# EAGLE design Arduino_Mega14x (EAGLE 9.5.2)
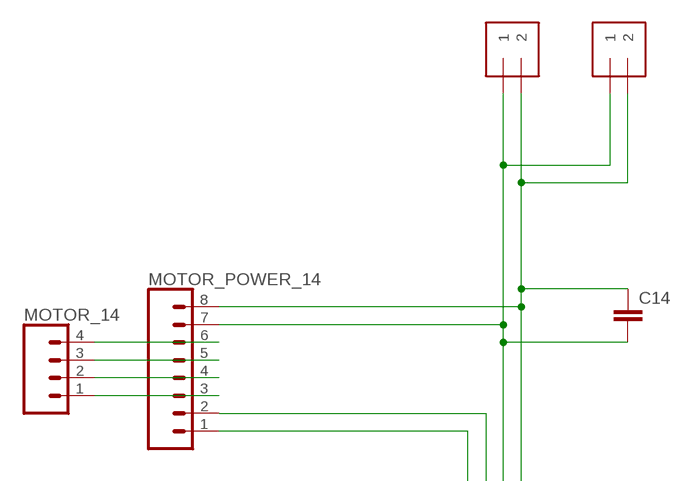
[diagram p0: schematic, sheet 1, part 1 of 3]
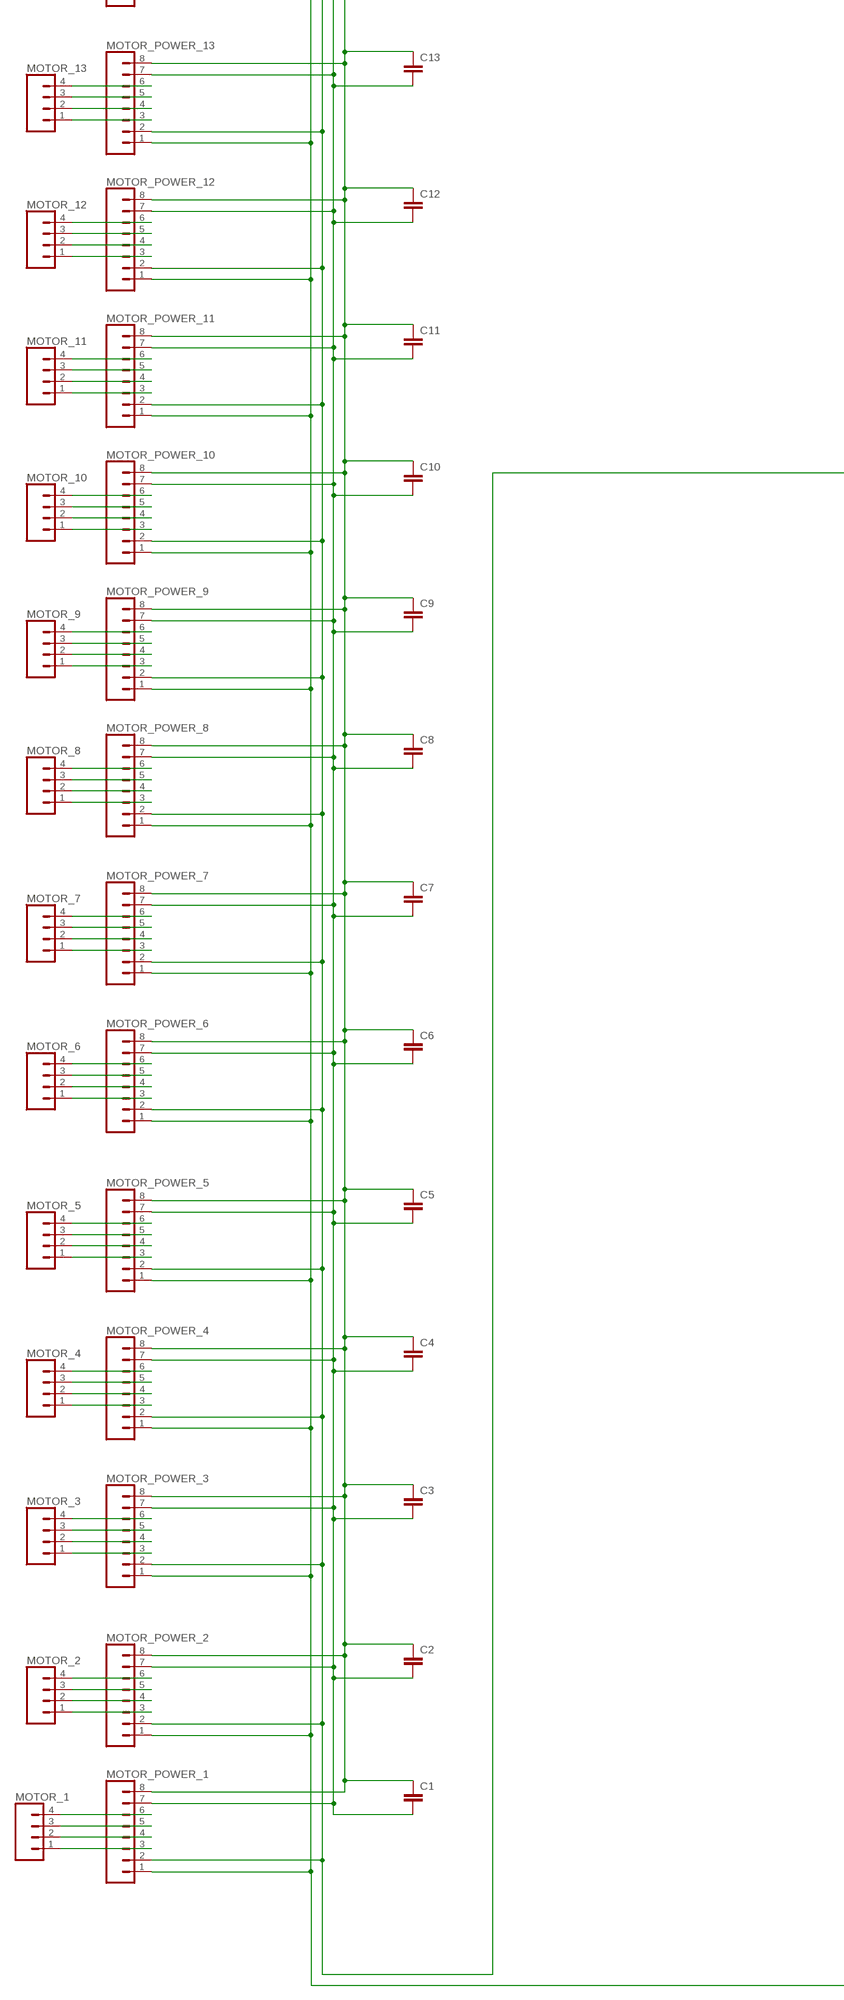
[diagram p1: schematic, sheet 1, part 2 of 3]
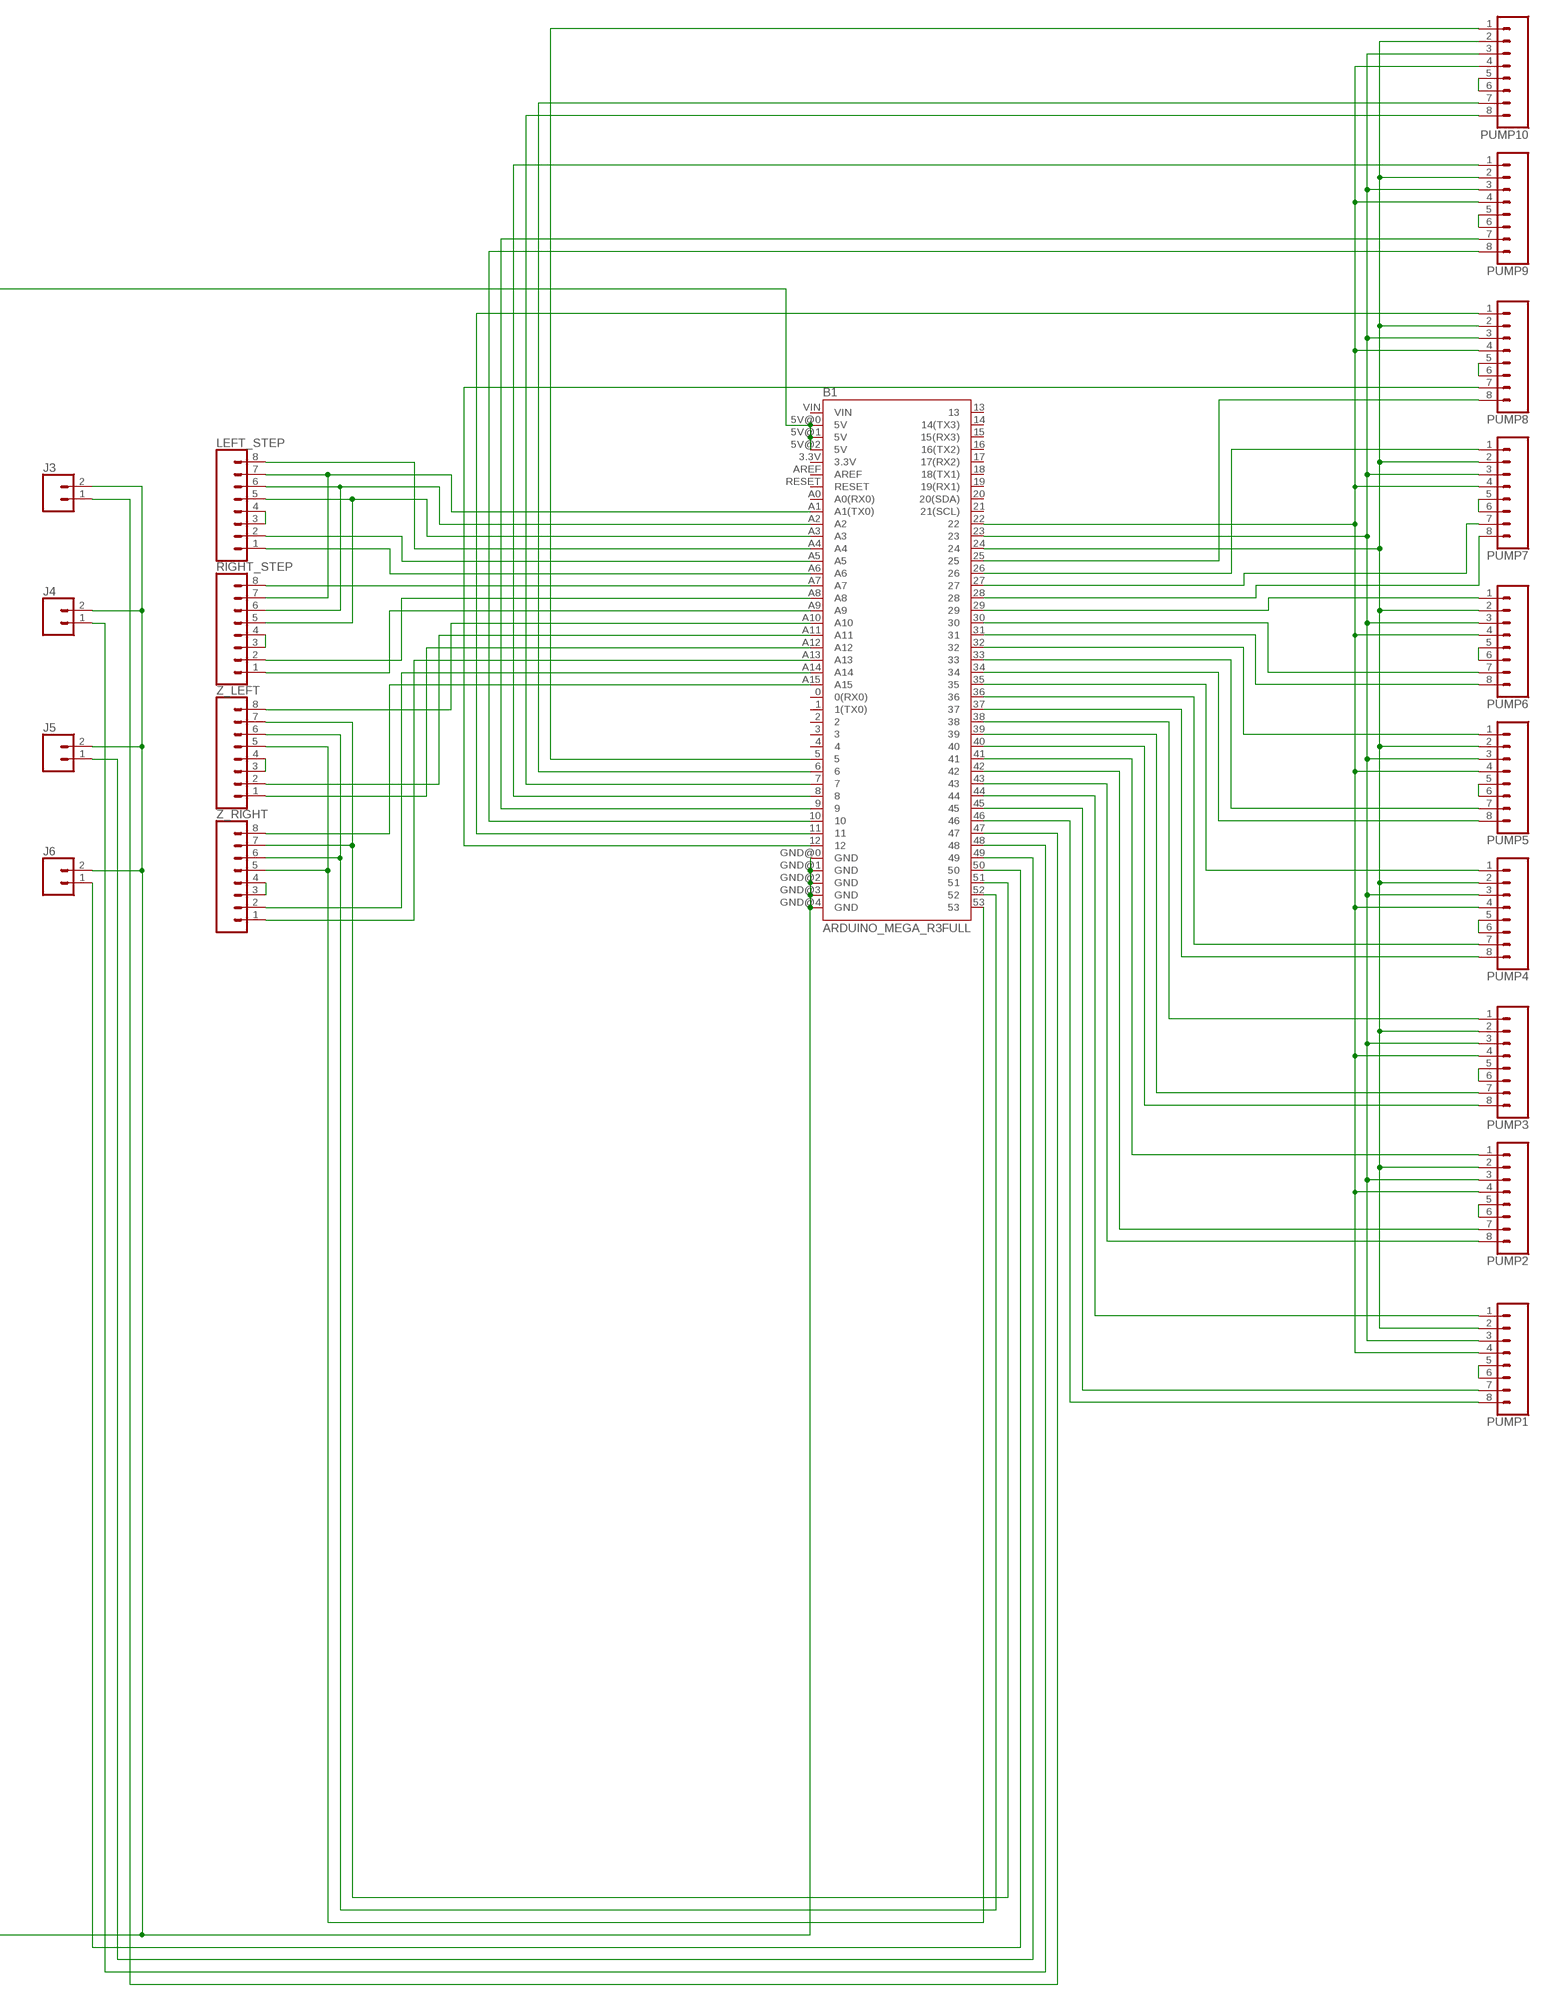
[diagram p2: schematic, sheet 1, part 3 of 3]

## Parts
B1  ARDUINO_MEGA_R3FULL  [ARDUINO_MEGA]
C1  C5/2.5  [C5B2.5]
C2  C5/2.5  [C5B2.5]
C3  C5/2.5  [C5B2.5]
C4  C5/2.5  [C5B2.5]
C5  C5/2.5  [C5B2.5]
C6  C5/2.5  [C5B2.5]
C7  C5/2.5  [C5B2.5]
C8  C5/2.5  [C5B2.5]
C9  C5/2.5  [C5B2.5]
C10  C5/2.5  [C5B2.5]
C11  C5/2.5  [C5B2.5]
C12  C5/2.5  [C5B2.5]
C13  C5/2.5  [C5B2.5]
C14  C5/2.5  [C5B2.5]
J1  1X2-3.5MM  [1X2-3.5MM]
J2  1X2-3.5MM  [1X2-3.5MM]
J3  CONN_02  [1X02]
J4  CONN_02  [1X02]
J5  CONN_02  [1X02]
J6  CONN_02  [1X02]
LEFT_STEP  CONN_08"  [1X08]
MOTOR_1  CONN_04  [1X04]
MOTOR_2  CONN_04  [1X04]
MOTOR_3  CONN_04  [1X04]
MOTOR_4  CONN_04  [1X04]
MOTOR_5  CONN_04  [1X04]
MOTOR_6  CONN_04  [1X04]
MOTOR_7  CONN_04  [1X04]
MOTOR_8  CONN_04  [1X04]
MOTOR_9  CONN_04  [1X04]
MOTOR_10  CONN_04  [1X04]
MOTOR_11  CONN_04  [1X04]
MOTOR_12  CONN_04  [1X04]
MOTOR_13  CONN_04  [1X04]
MOTOR_14  CONN_04  [1X04]
MOTOR_POWER_1  CONN_08"  [1X08]
MOTOR_POWER_2  CONN_08"  [1X08]
MOTOR_POWER_3  CONN_08"  [1X08]
MOTOR_POWER_4  CONN_08"  [1X08]
MOTOR_POWER_5  CONN_08"  [1X08]
MOTOR_POWER_6  CONN_08"  [1X08]
MOTOR_POWER_7  CONN_08"  [1X08]
MOTOR_POWER_8  CONN_08"  [1X08]
MOTOR_POWER_9  CONN_08"  [1X08]
MOTOR_POWER_10  CONN_08"  [1X08]
MOTOR_POWER_11  CONN_08"  [1X08]
MOTOR_POWER_12  CONN_08"  [1X08]
MOTOR_POWER_13  CONN_08"  [1X08]
MOTOR_POWER_14  CONN_08"  [1X08]
PUMP1  CONN_08"  [1X08]
PUMP2  CONN_08"  [1X08]
PUMP3  CONN_08"  [1X08]
PUMP4  CONN_08"  [1X08]
PUMP5  CONN_08"  [1X08]
PUMP6  CONN_08"  [1X08]
PUMP7  CONN_08"  [1X08]
PUMP8  CONN_08"  [1X08]
PUMP9  CONN_08"  [1X08]
PUMP10  CONN_08"  [1X08]
RIGHT_STEP  CONN_08"  [1X08]
Z_LEFT  CONN_08"  [1X08]
Z_RIGHT  CONN_08"  [1X08]

## Nets
N$1: MOTOR_1.1 MOTOR_POWER_1.3
N$2: MOTOR_1.2 MOTOR_POWER_1.4
N$3: MOTOR_1.3 MOTOR_POWER_1.5
N$4: LEFT_STEP.3 LEFT_STEP.4
N$5: MOTOR_1.4 MOTOR_POWER_1.6
N$6: MOTOR_2.1 MOTOR_POWER_2.3
N$7: MOTOR_2.2 MOTOR_POWER_2.4
N$8: RIGHT_STEP.3 RIGHT_STEP.4
N$9: MOTOR_2.3 MOTOR_POWER_2.5
N$10: MOTOR_2.4 MOTOR_POWER_2.6
N$11: MOTOR_3.1 MOTOR_POWER_3.3
N$12: MOTOR_3.2 MOTOR_POWER_3.4
N$13: MOTOR_3.3 MOTOR_POWER_3.5
N$14: MOTOR_3.4 MOTOR_POWER_3.6
N$15: MOTOR_4.1 MOTOR_POWER_4.3
N$16: MOTOR_4.2 MOTOR_POWER_4.4
N$17: MOTOR_4.3 MOTOR_POWER_4.5
N$18: Z_LEFT.3 Z_LEFT.4
N$19: MOTOR_4.4 MOTOR_POWER_4.6
N$20: MOTOR_5.1 MOTOR_POWER_5.3
N$21: MOTOR_5.2 MOTOR_POWER_5.4
N$22: MOTOR_5.3 MOTOR_POWER_5.5
N$23: MOTOR_5.4 MOTOR_POWER_5.6
N$24: MOTOR_6.1 MOTOR_POWER_6.3
N$25: Z_RIGHT.3 Z_RIGHT.4
N$26: MOTOR_6.2 MOTOR_POWER_6.4
N$27: PUMP1.5 PUMP1.6
N$28: MOTOR_6.3 MOTOR_POWER_6.5
N$29: MOTOR_6.4 MOTOR_POWER_6.6
N$30: MOTOR_7.1 MOTOR_POWER_7.3
N$31: MOTOR_7.2 MOTOR_POWER_7.4
N$32: PUMP2.5 PUMP2.6
N$33: MOTOR_7.3 MOTOR_POWER_7.5
N$34: MOTOR_7.4 MOTOR_POWER_7.6
N$35: PUMP3.5 PUMP3.6
N$36: MOTOR_8.1 MOTOR_POWER_8.3
N$37: MOTOR_8.2 MOTOR_POWER_8.4
N$38: MOTOR_8.3 MOTOR_POWER_8.5
N$39: MOTOR_8.4 MOTOR_POWER_8.6
N$40: PUMP4.5 PUMP4.6
N$41: MOTOR_9.1 MOTOR_POWER_9.3
N$42: MOTOR_9.2 MOTOR_POWER_9.4
N$43: MOTOR_9.3 MOTOR_POWER_9.5
N$44: PUMP5.5 PUMP5.6
N$45: MOTOR_9.4 MOTOR_POWER_9.6
N$46: MOTOR_10.1 MOTOR_POWER_10.3
N$47: MOTOR_10.2 MOTOR_POWER_10.4
N$48: PUMP6.5 PUMP6.6
N$49: MOTOR_10.3 MOTOR_POWER_10.5
N$50: MOTOR_10.4 MOTOR_POWER_10.6
N$51: MOTOR_11.1 MOTOR_POWER_11.3
N$52: PUMP7.5 PUMP7.6
N$53: MOTOR_11.2 MOTOR_POWER_11.4
N$54: MOTOR_11.3 MOTOR_POWER_11.5
N$55: MOTOR_11.4 MOTOR_POWER_11.6
N$56: PUMP8.5 PUMP8.6
N$57: MOTOR_12.1 MOTOR_POWER_12.3
N$58: MOTOR_12.2 MOTOR_POWER_12.4
N$59: MOTOR_12.3 MOTOR_POWER_12.5
N$60: PUMP9.5 PUMP9.6
N$61: MOTOR_12.4 MOTOR_POWER_12.6
N$62: MOTOR_13.1 MOTOR_POWER_13.3
N$63: MOTOR_13.2 MOTOR_POWER_13.4
N$64: PUMP10.5 PUMP10.6
N$65: MOTOR_13.3 MOTOR_POWER_13.5
N$66: MOTOR_13.4 MOTOR_POWER_13.6
N$67: MOTOR_14.1 MOTOR_POWER_14.3
N$68: MOTOR_14.2 MOTOR_POWER_14.4
N$69: MOTOR_14.3 MOTOR_POWER_14.5
N$70: MOTOR_14.4 MOTOR_POWER_14.6
N$71: B1.GND@0(GND) B1.GND@1(GND) B1.GND@2(GND) B1.GND@3(GND) B1.GND@4(GND) J3.2 J4.2 J5.2 J6.2 MOTOR_POWER_1.1 MOTOR_POWER_2.1 MOTOR_POWER_3.1 MOTOR_POWER_4.1 MOTOR_POWER_5.1 MOTOR_POWER_6.1 MOTOR_POWER_7.1 MOTOR_POWER_8.1 MOTOR_POWER_9.1 MOTOR_POWER_10.1 MOTOR_POWER_11.1 MOTOR_POWER_12.1 MOTOR_POWER_13.1 MOTOR_POWER_14.1
N$72: B1.A1(A1(TX0)) LEFT_STEP.7 RIGHT_STEP.7
N$73: B1.A2 LEFT_STEP.6 RIGHT_STEP.6
N$74: B1.A3 LEFT_STEP.5 RIGHT_STEP.5
N$75: B1.51 Z_LEFT.7 Z_RIGHT.7
N$76: B1.52 Z_LEFT.6 Z_RIGHT.6
N$77: B1.53 Z_LEFT.5 Z_RIGHT.5
N$78: B1.22 PUMP1.4 PUMP2.4 PUMP3.4 PUMP4.4 PUMP5.4 PUMP6.4 PUMP7.4 PUMP8.4 PUMP9.4 PUMP10.4
N$79: B1.23 PUMP1.3 PUMP2.3 PUMP3.3 PUMP4.3 PUMP5.3 PUMP6.3 PUMP7.3 PUMP8.3 PUMP9.3 PUMP10.3
N$80: B1.24 PUMP1.2 PUMP2.2 PUMP3.2 PUMP4.2 PUMP5.2 PUMP6.2 PUMP7.2 PUMP8.2 PUMP9.2 PUMP10.2
N$81: B1.A15 Z_RIGHT.8
N$82: B1.5V@0(5V) B1.5V@1(5V) B1.5V@2(5V) MOTOR_POWER_1.2 MOTOR_POWER_2.2 MOTOR_POWER_3.2 MOTOR_POWER_4.2 MOTOR_POWER_5.2 MOTOR_POWER_6.2 MOTOR_POWER_7.2 MOTOR_POWER_8.2 MOTOR_POWER_9.2 MOTOR_POWER_10.2 MOTOR_POWER_11.2 MOTOR_POWER_12.2 MOTOR_POWER_13.2 MOTOR_POWER_14.2
N$83: C1.2 C2.2 C3.2 C4.2 C5.2 C6.2 C7.2 C8.2 C9.2 C10.2 C11.2 C12.2 C13.2 C14.2 J1.1 J2.1 MOTOR_POWER_1.7 MOTOR_POWER_2.7 MOTOR_POWER_3.7 MOTOR_POWER_4.7 MOTOR_POWER_5.7 MOTOR_POWER_6.7 MOTOR_POWER_7.7 MOTOR_POWER_8.7 MOTOR_POWER_9.7 MOTOR_POWER_10.7 MOTOR_POWER_11.7 MOTOR_POWER_12.7 MOTOR_POWER_13.7 MOTOR_POWER_14.7
N$84: C1.1 C2.1 C3.1 C4.1 C5.1 C6.1 C7.1 C8.1 C9.1 C10.1 C11.1 C12.1 C13.1 C14.1 J1.2 J2.2 MOTOR_POWER_1.8 MOTOR_POWER_2.8 MOTOR_POWER_3.8 MOTOR_POWER_4.8 MOTOR_POWER_5.8 MOTOR_POWER_6.8 MOTOR_POWER_7.8 MOTOR_POWER_8.8 MOTOR_POWER_9.8 MOTOR_POWER_10.8 MOTOR_POWER_11.8 MOTOR_POWER_12.8 MOTOR_POWER_13.8 MOTOR_POWER_14.8
N$85: B1.A14 Z_RIGHT.2
N$86: B1.A13 Z_RIGHT.1
N$87: B1.A12 Z_LEFT.1
N$88: B1.A11 Z_LEFT.2
N$89: B1.A10 Z_LEFT.8
N$90: B1.A9 RIGHT_STEP.1
N$91: B1.A8 RIGHT_STEP.2
N$92: B1.A7 RIGHT_STEP.8
N$93: B1.A6 LEFT_STEP.1
N$94: B1.A5 LEFT_STEP.2
N$95: B1.A4 LEFT_STEP.8
N$96: B1.50 J6.1
N$97: B1.49 J5.1
N$98: B1.48 J4.1
N$99: B1.47 J3.1
N$100: B1.46 PUMP1.8
N$101: B1.45 PUMP1.7
N$102: B1.44 PUMP1.1
N$103: B1.43 PUMP2.8
N$104: B1.42 PUMP2.7
N$105: B1.41 PUMP2.1
N$106: B1.40 PUMP3.8
N$107: B1.39 PUMP3.7
N$108: B1.38 PUMP3.1
N$109: B1.37 PUMP4.8
N$110: B1.36 PUMP4.7
N$111: B1.35 PUMP4.1
N$112: B1.34 PUMP5.8
N$113: B1.33 PUMP5.7
N$114: B1.32 PUMP5.1
N$115: B1.31 PUMP6.8
N$116: B1.30 PUMP6.7
N$117: B1.29 PUMP6.1
N$118: B1.28 PUMP7.8
N$119: B1.27 PUMP7.7
N$120: B1.26 PUMP7.1
N$121: B1.25 PUMP8.8
N$122: B1.12 PUMP8.7
N$123: B1.11 PUMP8.1
N$124: B1.10 PUMP9.8
N$125: B1.9 PUMP9.7
N$126: B1.8 PUMP9.1
N$127: B1.7 PUMP10.8
N$128: B1.6 PUMP10.7
N$129: B1.5 PUMP10.1
Unconnected: B1.0(0(RX0)) B1.1(1(TX0)) B1.2 B1.3 B1.3.3V B1.4 B1.13 B1.14(14(TX3)) B1.15(15(RX3)) B1.16(16(TX2)) B1.17(17(RX2)) B1.18(18(TX1)) B1.19(19(RX1)) B1.20(20(SDA)) B1.21(21(SCL)) B1.A0(A0(RX0)) B1.AREF B1.RESET B1.VIN

## Library data of the parts
B1 = SparkFun-Mega_Shield:ARDUINO_MEGA_R3: Arduino Mega R3 ATmega2560 R3 compatible footprint. SparkFun Products: Arduino Mega 2560 R3 <https://www.sparkfun.com/products/11061>
C1-C14 = capacitor-wima:C: CAPACITOR naming: grid - package width
J1 J2 = adafruit:1X2: 3.5mm Terminal block http://www.ladyada.net/library/pcb/eaglelibrary.html
J3-J6 = SparkFun-Connectors:CONN_02: Multi connection point. Often used as Generic Header-pin footprint for 0.1 inch spaced/style header connections On any of the 0.1 inch spaced packages, you can populate with these: Break Away Headers - Straight <https://www.sparkfun.com/products/116> (PRT-00116) Break Away Male Headers - Right Angle <https://www.sparkfun.com/products/553> (PRT-00553) Female Headers <https://www.sparkfun.com/products/115> (PRT-00115) Break Away Headers - Machine Pin <https://www.sparkfun.com/products/117> (PRT-00117) Break Away Female Headers - Swiss Machine Pin <https://www.sparkfun.com/products/743> (PRT-00743) For SCREWTERMINALS and SPRING TERMINALS visit here: Screw Terimnals on SparkFun.com <https://www.sparkfun.com/search/results?term=Screw+Terminals> (5mm/3.5mm/2.54mm spacing) This device is also useful as a general connection point to wire up your design to another part of your project. Our various solder wires solder well into these plated through hole pads. Hook-Up Wire - Assortment (Stranded, 22 AWG) <https://www.sparkfun.com/products/11375> (PRT-11375) Hook-Up Wire - Assortment (Solid Core, 22 AWG) <https://www.sparkfun.com/products/11367> (PRT-11367) View the entire wire category on our website here <https://www.sparkfun.com/categories/141> Special notes: Molex polarized connector foot print use with: PRT-08233 with associated crimp pins and housings. 2.54_SCREWTERM for use with PRT-10571. 3.5mm Screw Terminal footprints for PRT-08084 5mm Screw Terminal footprints for use with PRT-08432
LEFT_STEP MOTOR_POWER_1-MOTOR_POWER_14 PUMP1-PUMP10 RIGHT_STEP Z_LEFT Z_RIGHT = SparkFun-Connectors:CONN_08: Multi connection point. Often used as Generic Header-pin footprint for 0.1 inch spaced/style header connections On any of the 0.1 inch spaced packages, you can populate with these: Break Away Headers - Straight <https://www.sparkfun.com/products/116> (PRT-00116) Break Away Male Headers - Right Angle <https://www.sparkfun.com/products/553> (PRT-00553) Female Headers <https://www.sparkfun.com/products/115> (PRT-00115) Break Away Headers - Machine Pin <https://www.sparkfun.com/products/117> (PRT-00117) Break Away Female Headers - Swiss Machine Pin <https://www.sparkfun.com/products/743> (PRT-00743) Arduino Stackable Header - 8 Pin <https://www.sparkfun.com/products/9279> (PRT-09279) For SCREWTERMINALS and SPRING TERMINALS visit here: Screw Terimnals on SparkFun.com <https://www.sparkfun.com/search/results?term=Screw+Terminals> (5mm/3.5mm/2.54mm spacing) This device is also useful as a general connection point to wire up your design to another part of your project. Our various solder wires solder well into these plated through hole pads. Hook-Up Wire - Assortment (Stranded, 22 AWG) <https://www.sparkfun.com/products/11375> (PRT-11375) Hook-Up Wire - Assortment (Solid Core, 22 AWG) <https://www.sparkfun.com/products/11367> (PRT-11367) View the entire wire category on our website here <https://www.sparkfun.com/categories/141> Special notes: Molex polarized connector foot print use with SKU : PRT-08231 with associated crimp pins and housings. 1MM SMD Version SKU: PRT-10208 NOTES ON THE VARIANTS LOCK and LOCK_LONGPADS... This footprint was designed to help hold the alignment of a through-hole component (i.e. 6-pin header) while soldering it into place. You may notice that each hole has been shifted either up or down by 0.005 of an inch from it's more standard position (which is a perfectly straight line). This slight alteration caused the pins (the squares in the middle) to touch the edges of the holes. Because they are alternating, it causes a "brace" to hold the component in place. 0.005 has proven to be the perfect amount of "off-center" position when using our standard breakaway headers. Although looks a little odd when you look at the bare footprint, once you have a header in there, the alteration is very hard to notice. Also,if you push a header all the way into place, it is covered up entirely on the bottom side.; PROD_ID: CONN-08438
MOTOR_1-MOTOR_14 = SparkFun-Connectors:CONN_04: Multi connection point. Often used as Generic Header-pin footprint for 0.1 inch spaced/style header connections On any of the 0.1 inch spaced packages, you can populate with these: Break Away Headers - Straight <https://www.sparkfun.com/products/116> (PRT-00116) Break Away Male Headers - Right Angle <https://www.sparkfun.com/products/553> (PRT-00553) Female Headers <https://www.sparkfun.com/products/115> (PRT-00115) Break Away Headers - Machine Pin <https://www.sparkfun.com/products/117> (PRT-00117) Break Away Female Headers - Swiss Machine Pin <https://www.sparkfun.com/products/743> (PRT-00743) For SCREWTERMINALS and SPRING TERMINALS visit here: Screw Terimnals on SparkFun.com <https://www.sparkfun.com/search/results?term=Screw+Terminals> (5mm/3.5mm/2.54mm spacing) This device is also useful as a general connection point to wire up your design to another part of your project. Our various solder wires solder well into these plated through hole pads. Hook-Up Wire - Assortment (Stranded, 22 AWG) <https://www.sparkfun.com/products/11375> (PRT-11375) Hook-Up Wire - Assortment (Solid Core, 22 AWG) <https://www.sparkfun.com/products/11367> (PRT-11367) View the entire wire category on our website here <https://www.sparkfun.com/categories/141> Special notes: Molex polarized connector foot print use with SKU : PRT-08231 with associated crimp pins and housings. 1MM SMD Version SKU: PRT-10208; PROD_ID: CONN-09696

## Board
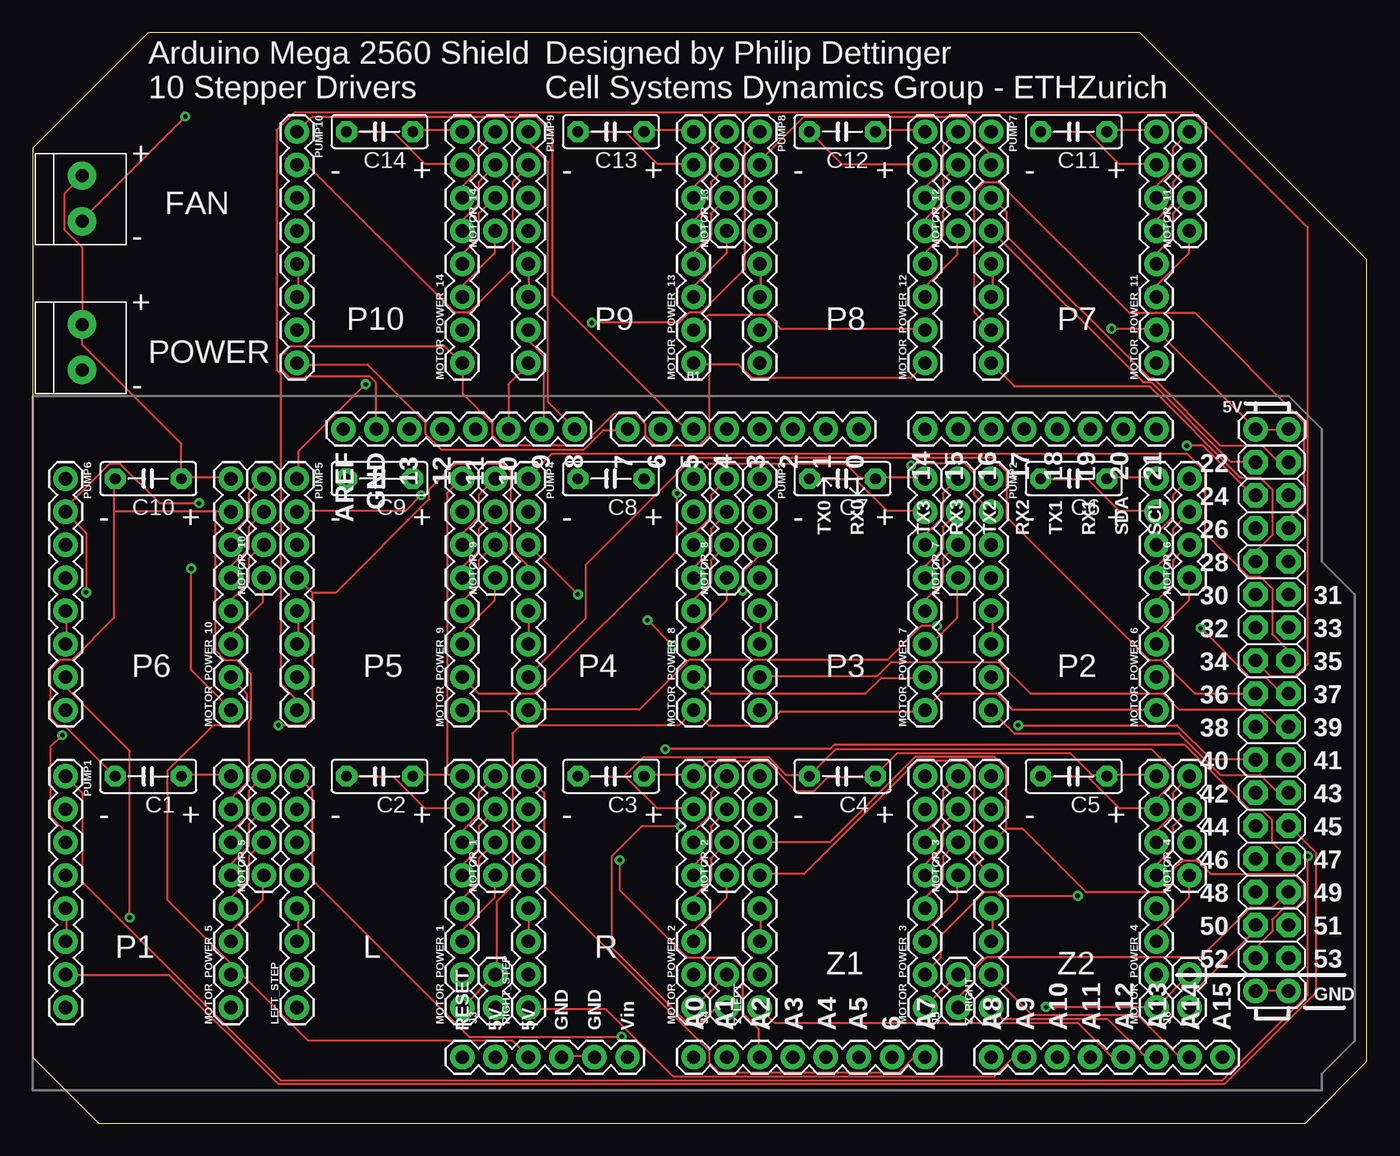
[diagram p3: board, top side]
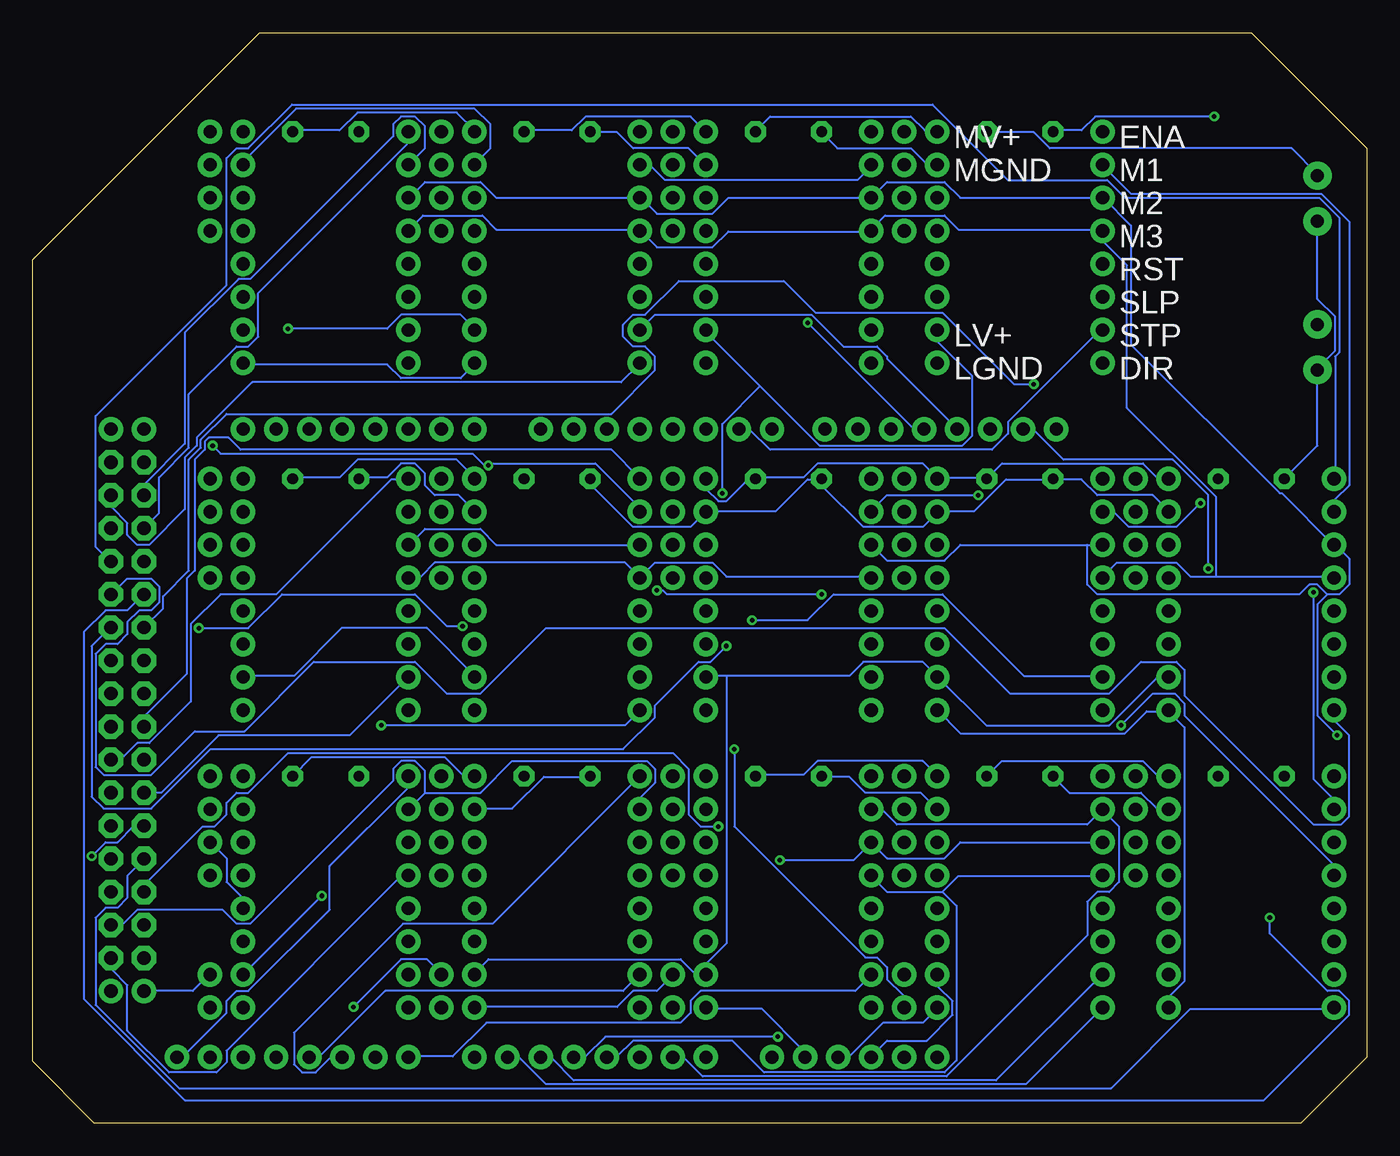
[diagram p4: board, bottom side, seen from below]

Size 102.54 x 83.82 mm. Coordinates in mm from the lower left corner, seen from the top.
Outline: 0,74.93 0,5.08 5.08,0 97.79,0 102.54,4.75 102.54,66.37 85.09,83.82 8.89,83.82 0,74.93
Copper layers (1*16): Top 0.035mm / dielectric 1.5mm / Bottom 0.035mm
Design rules "default": minimum track width 6mil, minimum drill 0.35mm, track to track 6mil, track to pad 6mil, pad to pad 6mil, via to via 6mil, smd to smd 6mil, copper to edge 40mil, drill to drill 6mil, minimum pad ring 10mil, minimum via ring 8mil, stop-mask expansion 4mil, vias tented up to drill 0mil, thermal gap 10mil

### Footprints (pad centres in the part's own frame; a part is rotated, then mirrored left to right if it is on the bottom)
ARDUINO_MEGA = drill 1.016 pad 1.88: 0 13.97,24.13; 1 11.43,24.13; 2 8.89,24.13; 3 6.35,24.13; 3.3V -13.97,-24.13; 4 3.81,24.13; 5 1.27,24.13; 5V@0 -11.43,-24.13; 5V@1 44.45,24.13; 5V@2 46.99,24.13; 6 -1.27,24.13; 7 -3.81,24.13; 8 -7.874,24.13; 9 -10.414,24.13; 10 -12.954,24.13; 11 -15.494,24.13; 12 -18.034,24.13; 13 -20.574,24.13; 14 19.05,24.13; 15 21.59,24.13; 16 24.13,24.13; 17 26.67,24.13; 18 29.21,24.13; 19 31.75,24.13; 20 34.29,24.13; 21 36.83,24.13; A0 1.27,-24.13; A1 3.81,-24.13; A2 6.35,-24.13; A3 8.89,-24.13; A4 11.43,-24.13; A5 13.97,-24.13; A6 16.51,-24.13; A7 19.05,-24.13; A8 24.13,-24.13; A9 26.67,-24.13; A10 29.21,-24.13; A11 31.75,-24.13; A12 34.29,-24.13; A13 36.83,-24.13; A14 39.37,-24.13; A15 41.91,-24.13; AREF -25.654,24.13; GND@0 -8.89,-24.13; GND@1 -6.35,-24.13; GND@2 44.45,-19.05; GND@3 46.99,-19.05; GND@4 -23.114,24.13; RESET -16.51,-24.13; VIN -3.81,-24.13 | drill 1.016 pad 1.88 octagon: 22 44.45,21.59; 23 46.99,21.59; 24 44.45,19.05; 25 46.99,19.05; 26 44.45,16.51; 27 46.99,16.51; 28 44.45,13.97; 29 46.99,13.97; 30 44.45,11.43; 31 46.99,11.43; 32 44.45,8.89; 33 46.99,8.89; 34 44.45,6.35; 35 46.99,6.35; 36 44.45,3.81; 37 46.99,3.81; 38 44.45,1.27; 39 46.99,1.27; 40 44.45,-1.27; 41 46.99,-1.27; 42 44.45,-3.81; 43 46.99,-3.81; 44 44.45,-6.35; 45 46.99,-6.35; 46 44.45,-8.89; 47 46.99,-8.89; 48 44.45,-11.43; 49 46.99,-11.43; 50 44.45,-13.97; 51 46.99,-13.97; 52 44.45,-16.51; 53 46.99,-16.51
C5B2.5 = drill 0.813 pad 1.6 octagon: 1 -2.54,0; 2 2.54,0
1X2-3.5MM = drill 1 pad 2.184: 1 1.8,0; 2 -1.7,0
1X02 = drill 1.016 pad 1.88: 1 0,0; 2 2.54,0
1X08 = drill 1.016 pad 1.88: 1 0,0; 2 2.54,0; 3 5.08,0; 4 7.62,0; 5 10.16,0; 6 12.7,0; 7 15.24,0; 8 17.78,0
1X04 = drill 1.016 pad 1.88: 1 0,0; 2 2.54,0; 3 5.08,0; 4 7.62,0

### Placement (x,y rotation side)
B1  49.53,29.21 0 top
C1  8.89,26.67 180 top
C2  26.67,26.67 180 top
C3  44.45,26.67 180 top
C4  62.23,26.67 180 top
C5  80.01,26.67 180 top
C6  80.01,49.53 180 top
C7  62.23,49.53 180 top
C8  44.45,49.53 180 top
C9  26.67,49.53 180 top
C10  8.89,49.53 180 top
C11  80.01,76.2 180 top
C12  62.23,76.2 180 top
C13  44.45,76.2 180 top
C14  26.67,76.2 180 top
J1  3.81,71.12 270 top
J2  3.81,59.69 270 top
J3  35.56,8.89 90 top
J4  53.34,8.89 90 top
J5  71.12,8.89 90 top
J6  88.9,8.89 90 top
LEFT_STEP  20.32,8.89 90 top
MOTOR_1  35.56,19.05 90 top
MOTOR_2  53.34,19.05 90 top
MOTOR_3  71.12,19.05 90 top
MOTOR_4  88.9,19.05 90 top
MOTOR_5  17.78,19.05 90 top
MOTOR_6  88.9,41.91 90 top
MOTOR_7  71.12,41.91 90 top
MOTOR_8  53.34,41.91 90 top
MOTOR_9  35.56,41.91 90 top
MOTOR_10  17.78,41.91 90 top
MOTOR_11  88.9,68.58 90 top
MOTOR_12  71.12,68.58 90 top
MOTOR_13  53.34,68.58 90 top
MOTOR_14  35.56,68.58 90 top
MOTOR_POWER_1  33.02,8.89 90 top
MOTOR_POWER_2  50.8,8.89 90 top
MOTOR_POWER_3  68.58,8.89 90 top
MOTOR_POWER_4  86.36,8.89 90 top
MOTOR_POWER_5  15.24,8.89 90 top
MOTOR_POWER_6  86.36,31.75 90 top
MOTOR_POWER_7  68.58,31.75 90 top
MOTOR_POWER_8  50.8,31.75 90 top
MOTOR_POWER_9  33.02,31.75 90 top
MOTOR_POWER_10  15.24,31.75 90 top
MOTOR_POWER_11  86.36,58.42 90 top
MOTOR_POWER_12  68.58,58.42 90 top
MOTOR_POWER_13  50.8,58.42 90 top
MOTOR_POWER_14  33.02,58.42 90 top
PUMP1  2.54,26.67 270 top
PUMP2  73.66,49.53 270 top
PUMP3  55.88,49.53 270 top
PUMP4  38.1,49.53 270 top
PUMP5  20.32,49.53 270 top
PUMP6  2.54,49.53 270 top
PUMP7  73.66,76.2 270 top
PUMP8  55.88,76.2 270 top
PUMP9  38.1,76.2 270 top
PUMP10  20.32,76.2 270 top
RIGHT_STEP  38.1,8.89 90 top
Z_LEFT  55.88,8.89 90 top
Z_RIGHT  73.66,8.89 90 top

### Tracks (layer width: path | path; a pad name or v marks a point on that pad's centre or on a via)
N$1
  Top 0.152: MOTOR_POWER_1.3 33.07,13.97 33.07,14.88 35.51,17.32 35.51,19 MOTOR_1.1
N$2
  Top 0.152: MOTOR_POWER_1.4 33.07,16.56 33.07,17.32 34.29,18.54 34.29,20.37 35.51,21.59 MOTOR_1.2
N$3
  Top 0.152: MOTOR_POWER_1.5 33.07,19.15 33.07,19.91 34.29,21.13 34.29,22.81 35.51,24.03 MOTOR_1.3
N$4
  Top 0.152: LEFT_STEP.3 20.42,13.97 20.42,16.41 LEFT_STEP.4
N$5
  Top 0.152: MOTOR_1.4 34.29,25.4 34.29,23.72 33.07,22.5 33.07,21.59 MOTOR_POWER_1.6
N$6
  Top 0.152: MOTOR_2.1 53.34,17.32 50.9,14.88 50.9,13.97 MOTOR_POWER_2.3
N$7
  Top 0.152: MOTOR_2.2 52.12,20.37 52.12,18.69 50.9,17.48 50.9,16.56 MOTOR_POWER_2.4
N$8
  Top 0.152: RIGHT_STEP.4 RIGHT_STEP.3
N$9
  Top 0.152: MOTOR_POWER_2.5 50.9,19.15 50.9,19.91 52.12,21.13 52.12,22.81 53.34,24.03 MOTOR_2.3
N$10
  Top 0.152: MOTOR_POWER_2.6 50.9,21.59 50.9,22.5 52.12,23.72 52.12,25.4 53.34,26.62 MOTOR_2.4
N$11
  Top 0.152: MOTOR_POWER_3.3 68.58,14.73 71.02,17.17 71.02,19 MOTOR_3.1
N$12
  Top 0.152: MOTOR_POWER_3.4 68.58,17.32 69.95,18.69 69.95,20.52 71.02,21.59 MOTOR_3.2
N$13
  Top 0.152: MOTOR_POWER_3.5 68.58,19.91 69.95,21.29 69.95,22.96 MOTOR_3.3
N$14
  Top 0.152: MOTOR_POWER_3.6 68.58,22.35 69.95,23.72 69.95,25.55 71.02,26.62 MOTOR_3.4
N$15
  Top 0.152: MOTOR_POWER_4.3 86.41,13.97 86.41,14.88 88.85,17.32 88.85,19 MOTOR_4.1
N$16
  Bottom 0.152: MOTOR_POWER_4.4 86.41,16.56 86.41,17.32 87.63,18.54 87.63,20.37 88.85,21.59 MOTOR_4.2
N$17
  Top 0.152: MOTOR_POWER_4.5 86.41,19.15 86.41,19.91 87.63,21.13 87.63,22.81 88.85,24.03 MOTOR_4.3
N$18
  Top 0.152: Z_LEFT.3 55.93,13.97 55.93,16.41 Z_LEFT.4
N$19
  Top 0.152: MOTOR_4.4 87.63,25.4 87.63,23.72 86.41,22.5 86.41,21.59 MOTOR_POWER_4.6
N$20
  Top 0.152: MOTOR_POWER_5.3 15.24,14.73 17.68,17.17 17.68,19 MOTOR_5.1
N$21
  Top 0.152: MOTOR_POWER_5.4 15.24,17.32 16.61,18.69 16.61,20.52 17.68,21.59 MOTOR_5.2
N$22
  Top 0.152: MOTOR_POWER_5.5 15.24,19.91 16.61,21.29 16.61,22.96 MOTOR_5.3
N$23
  Top 0.152: MOTOR_POWER_5.6 15.24,22.35 16.61,23.72 16.61,25.55 17.68,26.62 MOTOR_5.4
N$24
  Top 0.152: MOTOR_POWER_6.3 86.41,36.83 86.41,37.74 88.85,40.18 88.85,41.86 MOTOR_6.1
N$25
  Top 0.152: Z_RIGHT.3 73.76,13.97 73.76,16.41 Z_RIGHT.4
N$26
  Top 0.152: MOTOR_POWER_6.4 86.41,39.42 86.41,40.18 87.63,41.4 87.63,43.23 88.85,44.45 MOTOR_6.2
N$27
  Top 0.152: PUMP1.6 2.59,13.97 2.59,16.41 PUMP1.5
N$28
  Top 0.152: MOTOR_POWER_6.5 86.41,42.01 86.41,42.77 87.63,43.99 87.63,45.67 88.85,46.89 MOTOR_6.3
N$29
  Top 0.152: MOTOR_6.4 87.63,48.26 87.63,46.58 86.41,45.36 86.41,44.45 MOTOR_POWER_6.6
N$30
  Top 0.152: MOTOR_POWER_7.3 69.04,36.83 71.02,38.81 71.02,41.86 MOTOR_7.1
N$31
  Top 0.152: MOTOR_POWER_7.4 68.58,40.18 69.95,41.55 69.95,43.38 71.02,44.45 MOTOR_7.2
N$32
  Top 0.152: PUMP2.6 73.76,36.83 73.76,39.27 PUMP2.5
N$33
  Top 0.152: MOTOR_POWER_7.5 68.58,42.77 69.95,44.14 69.95,45.82 MOTOR_7.3
N$34
  Top 0.152: MOTOR_POWER_7.6 68.58,45.21 69.95,46.58 69.95,48.41 71.02,49.48 MOTOR_7.4
N$35
  Top 0.152: PUMP3.6 55.93,36.83 55.93,39.27 PUMP3.5
N$36
  Top 0.152: MOTOR_8.1 53.34,40.18 50.9,37.74 50.9,36.83 MOTOR_POWER_8.3
N$37
  Top 0.152: MOTOR_8.2 52.12,43.23 52.12,41.55 50.9,40.34 50.9,39.42 MOTOR_POWER_8.4
N$38
  Top 0.152: MOTOR_POWER_8.5 50.9,42.01 50.9,42.77 52.12,43.99 52.12,45.67 53.34,46.89 MOTOR_8.3
N$39
  Top 0.152: MOTOR_POWER_8.6 50.9,44.45 50.9,45.36 52.12,46.58 52.12,48.26 53.34,49.48 MOTOR_8.4
N$40
  Top 0.152: PUMP4.5 PUMP4.6
N$41
  Top 0.152: MOTOR_POWER_9.3 33.07,36.83 33.07,37.74 35.51,40.18 35.51,41.86 MOTOR_9.1
N$42
  Top 0.152: MOTOR_POWER_9.4 33.07,39.42 33.07,40.18 34.29,41.4 34.29,43.23 35.51,44.45 MOTOR_9.2
N$43
  Top 0.152: MOTOR_POWER_9.5 33.07,42.01 33.07,42.77 34.29,43.99 34.29,45.67 35.51,46.89 MOTOR_9.3
N$44
  Top 0.152: PUMP5.6 20.42,36.83 20.42,39.27 PUMP5.5
N$45
  Top 0.152: MOTOR_9.4 34.29,48.26 34.29,46.58 33.07,45.36 33.07,44.45 MOTOR_POWER_9.6
N$46
  Top 0.152: MOTOR_POWER_10.3 15.24,37.59 17.68,40.03 17.68,41.86 MOTOR_10.1
N$47
  Top 0.152: MOTOR_POWER_10.4 15.24,40.18 16.61,41.55 16.61,43.38 17.68,44.45 MOTOR_10.2
N$48
  Top 0.152: PUMP6.6 2.59,36.83 2.59,39.27 PUMP6.5
N$49
  Top 0.152: MOTOR_POWER_10.5 15.24,42.77 16.61,44.14 16.61,45.82 MOTOR_10.3
N$50
  Top 0.152: MOTOR_POWER_10.6 15.24,45.21 16.61,46.58 16.61,48.41 17.68,49.48 MOTOR_10.4
N$51
  Top 0.152: MOTOR_POWER_11.3 86.41,63.5 86.41,64.41 88.85,66.85 88.85,68.53 MOTOR_11.1
N$52
  Top 0.152: PUMP7.6 73.76,63.5 73.76,65.94 PUMP7.5
N$53
  Top 0.152: MOTOR_POWER_11.4 86.41,66.09 86.41,66.85 87.63,68.07 87.63,69.9 88.85,71.12 MOTOR_11.2
N$54
  Top 0.152: MOTOR_POWER_11.5 86.41,68.68 86.41,69.44 87.63,70.66 87.63,72.34 88.85,73.56 MOTOR_11.3
N$55
  Top 0.152: MOTOR_11.4 87.63,74.93 87.63,73.25 86.41,72.03 86.41,71.12 MOTOR_POWER_11.6
N$56
  Top 0.152: PUMP8.6 55.93,63.5 55.93,65.94 PUMP8.5
N$57
  Top 0.152: MOTOR_POWER_12.3 68.58,64.26 71.02,66.7 71.02,68.53 MOTOR_12.1
N$58
  Top 0.152: MOTOR_POWER_12.4 68.58,66.85 69.95,68.22 69.95,70.05 71.02,71.12 MOTOR_12.2
N$59
  Top 0.152: MOTOR_POWER_12.5 68.58,69.44 69.95,70.82 69.95,72.49 MOTOR_12.3
N$60
  Top 0.152: PUMP9.5 PUMP9.6
N$61
  Top 0.152: MOTOR_POWER_12.6 68.58,71.88 69.95,73.25 69.95,75.08 71.02,76.15 MOTOR_12.4
N$62
  Top 0.152: MOTOR_13.1 53.34,66.85 50.9,64.41 50.9,63.5 MOTOR_POWER_13.3
N$63
  Top 0.152: MOTOR_13.2 52.12,69.9 52.12,68.22 50.9,67.01 50.9,66.09 MOTOR_POWER_13.4
N$64
  Top 0.152: PUMP10.6 20.42,63.5 20.42,65.94 PUMP10.5
N$65
  Top 0.152: MOTOR_POWER_13.5 50.9,68.68 50.9,69.44 52.12,70.66 52.12,72.34 53.34,73.56 MOTOR_13.3
N$66
  Top 0.152: MOTOR_POWER_13.6 50.9,71.12 50.9,72.03 52.12,73.25 52.12,74.93 53.34,76.15 MOTOR_13.4
N$67
  Top 0.152: MOTOR_POWER_14.3 33.07,63.5 33.07,64.41 35.51,66.85 35.51,68.53 MOTOR_14.1
N$68
  Top 0.152: MOTOR_POWER_14.4 33.07,66.09 33.07,66.85 34.29,68.07 34.29,69.9 35.51,71.12 MOTOR_14.2
N$69
  Top 0.152: MOTOR_POWER_14.5 33.07,68.68 33.07,69.44 34.29,70.66 34.29,72.34 35.51,73.56 MOTOR_14.3
N$70
  Top 0.152: MOTOR_14.4 34.29,74.93 34.29,73.25 33.07,72.03 33.07,71.12 MOTOR_POWER_14.6
N$71  (via drill 0.35)
  Top 0.152: B1.GND@3 B1.GND@2 | J6.2 MOTOR_POWER_4.1 86.26,8.94 v77.88,8.94 | MOTOR_POWER_3.1 68.58,8.94 71.02,11.38 J5.2 | MOTOR_POWER_2.1 50.9,8.94 53.34,11.38 J4.2 | B1.GND@0 40.69,5.13 43.13,5.13 B1.GND@1 | MOTOR_POWER_1.1 J3.2 35.66,11.53 35.66,17.02 36.88,18.24 36.88,29.97 37.49,30.58 | B1.GND@4 26.36,53.44 26.36,56.95 25.91,57.4 21.03,57.4 20.88,57.25 19.81,57.25 19.05,58.01 19.05,58.93 19.81,59.69 31.7,59.69 32.92,58.47 MOTOR_POWER_14.1 33.07,58.32 33.07,56.03 35.36,53.75 35.36,52.83 36.12,52.07 42.22,52.07 44.65,54.51 46.33,54.51 47.09,53.75 47.09,52.83 47.85,52.07 51.21,52.07 51.97,52.83 51.97,58.32 | 51.97,58.32 54.25,58.32 55.32,57.25 67.51,57.25 68.58,58.32 MOTOR_POWER_12.1 | 51.97,58.32 50.9,58.32 MOTOR_POWER_13.1 | 37.49,30.58 36.42,31.65 33.07,31.65 MOTOR_POWER_9.1 | 37.49,30.58 49.68,30.58 50.75,31.65 MOTOR_POWER_8.1 51.97,30.58 56.39,30.58 57.45,31.65 68.58,31.65 MOTOR_POWER_7.1 68.58,31.8 69.8,33.02 74.07,33.02 75.29,31.8 86.26,31.8 MOTOR_POWER_6.1 | v12.19,42.62 12.19,34.85 15.24,31.8 MOTOR_POWER_10.1
  Bottom 0.152: B1.GND@2 90.22,10.16 89,11.38 J6.2 | B1.GND@0 40.54,5.13 39.78,5.13 37.19,7.72 34.14,7.72 33.07,8.79 MOTOR_POWER_1.1 | MOTOR_POWER_2.1 50.75,8.79 46.48,8.79 43.28,5.59 43.28,5.08 B1.GND@1 | MOTOR_POWER_3.1 68.58,8.94 57.61,8.94 56.39,10.16 54.56,10.16 53.34,11.38 J4.2 | v77.88,8.94 74.22,12.6 72.24,12.6 71.17,11.53 J5.2 | MOTOR_POWER_11.1 86.26,58.32 75.29,58.32 74.22,57.25 69.65,57.25 68.58,58.32 MOTOR_POWER_12.1 | MOTOR_POWER_5.1 15.24,9.7 14.02,10.92 14.02,30.43 15.24,31.65 | 15.24,31.65 16.92,31.65 18.59,29.97 31.24,29.97 MOTOR_POWER_9.1 | 15.24,31.65 MOTOR_POWER_10.1 | v12.19,42.62 12.19,48.26 14.94,51 23.32,51 25.6,53.29 26.36,53.29 B1.GND@4
N$72
  Bottom 0.152: B1.A1 53.34,4.98 52.43,4.98 51.05,3.61 32.31,3.61 21.49,14.43 21.49,17.02 20.73,17.78 19.81,17.78 19.05,18.54 19.05,22.81 20.27,24.03 LEFT_STEP.7 21.49,22.96 36.12,22.96 37.19,24.03 38.1,24.03 RIGHT_STEP.7
N$73  (via drill 0.35)
  Top 0.152: v45.11,20.22 45.11,17.93 50.29,12.75 53.8,12.75 54.56,11.99 54.56,8.48 55.78,7.26 55.78,5.13 B1.A2
  Bottom 0.152: LEFT_STEP.6 31.24,21.59 32.46,20.37 36.88,20.37 RIGHT_STEP.6 39.47,20.22 v45.11,20.22
N$74
  Bottom 0.152: 32.61,17.78 31.39,19 20.42,19 LEFT_STEP.5 | 32.61,17.78 36.88,17.78 38.1,19 RIGHT_STEP.5 | 32.61,17.78 31.55,16.71 31.55,4.83 32.46,3.91 46.33,3.91 48.77,6.35 56.39,6.35 57.61,5.13 58.37,5.13 B1.A3
N$75
  Bottom 0.152: 72.39,25.4 68.12,25.4 65.68,27.84 55.32,27.84 54.71,27.23 54.71,26.16 55.78,25.09 55.78,24.18 Z_LEFT.7 | Z_RIGHT.7 72.39,25.4 | 72.39,25.4 72.39,27.08 73.15,27.84 74.22,27.84 74.83,27.23 74.83,26.31 85.8,15.34 86.87,15.34 87.94,16.41 94.49,16.41 95.56,15.34 96.47,15.34 B1.51
N$76
  Top 0.152: Z_LEFT.6 61.27,21.59 67.82,28.14 73.91,28.14 74.83,27.23 74.83,22.66 | 74.83,22.66 73.76,21.59 Z_RIGHT.6 | 74.83,22.66 76.05,22.66 80.92,17.78 86.87,17.78 87.63,18.54 87.63,19.46 88.39,20.22 89.46,20.22 90.53,19.15 96.93,19.15 97.69,18.39 97.69,17.17 97.08,16.56 96.16,16.56 95.25,15.65 95.25,14.73 94.03,13.51 94.03,12.75 B1.52
N$77
  Top 0.152: Z_LEFT.5 55.93,19.15 59.28,19.15 67.97,27.84 71.63,27.84 72.39,27.08 72.39,20.37 73.61,19.15 Z_RIGHT.5
  Bottom 0.152: B1.53 96.47,12.6 96.47,11.84 95.25,10.62 95.25,7.11 92.05,3.91 88.39,3.91 87.63,4.67 87.63,5.59 74.22,19 73.76,19 Z_RIGHT.5
N$78  (via drill 0.35)
  Top 0.152: B1.22 93.88,50.85 92.05,50.85 85.95,56.95 85.34,56.95 73.76,68.53 PUMP7.4 | v18.9,30.58 20.88,30.58 21.49,31.19 21.49,40.79 | 21.49,40.79 20.42,41.86 PUMP5.4 | PUMP4.4 38.1,42.77 36.73,44.14 36.73,50.09 36.12,50.7 32.46,50.7 30.48,48.72 30.48,47.95 23.32,40.79 21.49,40.79
  Bottom 0.152: PUMP7.4 73.61,68.68 72.54,69.75 67.97,69.75 66.9,68.68 55.93,68.68 PUMP8.4 55.78,68.53 54.56,67.31 50.29,67.31 49.07,68.53 38.1,68.53 PUMP9.4 38.1,68.68 37.03,69.75 32.46,69.75 31.39,68.68 20.42,68.68 PUMP10.4 20.27,68.53 20.27,67.77 18.44,65.94 18.44,54.97 11.58,48.11 11.58,42.01 | PUMP4.4 38.1,42.01 49.23,42.01 50.29,43.08 54.71,43.08 PUMP3.4 55.93,42.01 57,43.08 71.63,43.08 72.69,42.01 73.61,42.01 PUMP2.4 | v18.9,30.58 16.46,33.02 14.78,33.02 14.02,32.26 14.02,31.34 2.59,19.91 2.59,19.15 PUMP1.4 | 11.58,42.01 13.56,42.01 14.63,43.08 19.2,43.08 20.27,42.01 PUMP5.4 | 11.58,42.01 2.59,42.01 PUMP6.4
N$79  (via drill 0.35)
  Top 0.152: v2.29,29.82 1.37,28.9 1.37,23.57 2.44,22.5 2.44,21.59 PUMP1.3 | v54.56,40.95 54.56,42.32 55.78,43.54 55.78,44.45 PUMP3.3 | PUMP4.3 v41.91,40.64 | B1.23 96.47,50.85 95.71,50.85 94.49,52.07 91.29,52.07 86.11,57.25 85.8,57.25 74.83,68.22 74.83,70.05 73.76,71.12 PUMP7.3
  Bottom 0.152: PUMP3.3 66.9,44.45 68.12,45.67 72.39,45.67 73.61,44.45 PUMP2.3 | 21.49,44.45 31.24,44.45 32.46,43.23 36.88,43.23 PUMP4.3 | 21.49,44.45 PUMP5.3 | v2.29,29.82 3.81,31.34 3.81,39.88 3.05,40.64 | 3.05,40.64 2.13,40.64 1.37,41.4 1.37,43.38 2.44,44.45 PUMP6.3 2.59,44.45 6.55,48.41 6.71,48.41 18.14,59.84 18.14,68.99 20.27,71.12 PUMP10.3 31.24,71.12 32.46,72.34 36.88,72.34 PUMP9.3 49.07,71.12 50.29,69.9 54.56,69.9 55.78,71.12 PUMP8.3 66.9,71.12 68.12,72.34 72.39,72.34 73.61,71.12 PUMP7.3 | 21.49,44.45 21.49,41.4 20.73,40.64 5.18,40.64 4.42,41.4 3.81,41.4 3.05,40.64 | v54.56,40.95 54.1,40.95 53.8,40.64 v41.91,40.64
N$80  (via drill 0.35)
  Top 0.152: v29.87,48.26 28.65,47.04 20.42,47.04 PUMP5.2 | v4.12,40.79 4.12,45.36 2.59,46.89 PUMP6.2 2.59,47.04 2.59,47.35 5.94,50.7 6.71,50.7 9.75,47.65 v12.8,47.65 | v67.51,50.55 67.82,50.55 67.97,50.7 71.63,50.7 72.39,49.94 72.39,48.26 PUMP2.2 | PUMP10.2 20.42,73.56 21.18,73.56 32.46,62.28 33.53,62.28 36.88,65.63 36.88,72.34 38.1,73.56 PUMP9.2 | PUMP7.2 73.61,73.71 73.61,74.47 72.39,75.69 72.39,76.61 71.63,77.37 59.28,77.37 55.93,74.02 55.93,73.71 PUMP8.2 | v88.7,52.07 89.92,52.07 93.73,48.26 B1.24
  Bottom 0.152: v29.87,48.26 36.88,48.26 38.1,47.04 PUMP4.2 | v4.12,40.79 4.12,26.47 2.59,24.94 2.59,24.18 PUMP1.2 | v12.8,47.65 14.63,45.82 18.29,45.82 19.36,46.89 20.27,46.89 PUMP5.2 | PUMP3.2 55.93,47.04 55.93,47.35 59.28,50.7 67.36,50.7 v67.51,50.55 67.82,50.55 68.73,51.46 88.09,51.46 v88.7,52.07 | PUMP8.2 55.78,73.56 55.02,73.56 53.95,72.49 39.17,72.49 38.1,73.56 PUMP9.2 | PUMP7.2 72.39,74.93 72.39,76.61 73.15,77.37 74.22,77.37 74.83,76.76 74.83,75.84 85.8,64.87 86.72,64.87 90.83,60.76 90.83,52.22 93.88,49.17 93.88,48.26 B1.24 | PUMP6.2 2.44,47.04 2.44,47.95 1.37,49.02 1.37,69.29 3.5,71.43 18.14,71.43 20.27,73.56 PUMP10.2
N$81
  Bottom 0.152: Z_RIGHT.8 73.76,26.62 73.76,25.7 79.7,19.76 79.7,16.41 85.95,10.16 86.87,10.16 87.63,9.4 87.63,8.48 90.98,5.13 91.44,5.13 B1.A15
N$82  (via drill 0.35)
  Top 0.152: B1.5V@2 96.47,53.29 94.03,53.29 B1.5V@1 MOTOR_POWER_11.2 86.26,61.06 v82.91,61.06 | MOTOR_POWER_13.2 51.97,62.13 56.39,62.13 57.45,61.06 68.58,61.06 MOTOR_POWER_12.2 | v80.31,17.48 74.37,17.48 74.07,17.78 73.15,17.78 69.8,14.43 69.8,12.75 68.58,11.53 MOTOR_POWER_3.2 | B1.5V@0 38.1,5.13 36.88,6.35 21.18,6.35 16.15,11.38 15.24,11.38 MOTOR_POWER_5.2 15.24,12.29 10.36,17.17 10.36,27.08 13.87,30.58 15.85,30.58 16.46,31.19 16.46,33.02 15.24,34.24 MOTOR_POWER_10.2 | MOTOR_POWER_7.2 68.58,34.24 65.23,34.24 64.01,33.02 52.12,33.02 50.9,34.24 MOTOR_POWER_8.2 | v49.53,48.41 49.53,43.99 38.56,33.02 34.29,33.02 MOTOR_POWER_9.2
  Bottom 0.152: 46.63,56.64 50.9,60.91 MOTOR_POWER_13.2 | 46.63,56.64 42.06,52.07 31.09,52.07 30.33,52.83 30.33,57.4 32.92,59.99 32.92,60.91 MOTOR_POWER_14.2 | v82.91,61.06 75.29,61.06 74.22,62.13 69.65,62.13 68.58,61.06 MOTOR_POWER_12.2 | MOTOR_POWER_3.2 68.58,11.53 67.51,12.6 52.73,12.6 51.66,11.53 50.9,11.53 MOTOR_POWER_2.2 50.75,11.53 50.75,12.29 49.23,13.82 49.23,34.39 | v80.31,17.48 MOTOR_POWER_4.2 | MOTOR_POWER_1.2 32.92,11.38 32.92,10.46 31.85,9.4 31.85,8.33 33.83,6.35 36.88,6.35 38.1,5.13 B1.5V@0 | MOTOR_POWER_10.2 15.24,34.24 16.15,34.24 19.81,30.58 29.26,30.58 32.92,34.24 MOTOR_POWER_9.2 33.07,34.39 34.14,35.46 38.71,35.46 39.78,34.39 49.23,34.39 | 49.23,34.39 50.75,34.39 MOTOR_POWER_8.2 | MOTOR_POWER_6.2 86.26,34.39 82.45,34.39 78.79,38.05 72.24,38.05 68.58,34.39 MOTOR_POWER_7.2 | 46.63,56.64 49.53,53.75 v49.53,48.41
N$83  (via drill 0.35)
  Top 0.152: C5.2 77.57,26.62 81.08,26.62 83.52,24.18 86.26,24.18 MOTOR_POWER_4.7 86.41,24.18 86.41,24.94 87.63,26.16 87.63,27.08 85.95,28.75 61.72,28.75 59.74,26.77 C4.2 59.59,26.77 57.91,26.77 56.54,28.14 46.94,28.14 45.41,26.62 | 45.41,26.62 45.57,26.62 48.01,24.18 50.75,24.18 MOTOR_POWER_2.7 | 45.41,26.62 41.91,26.62 C3.2 | C2.2 24.23,26.62 27.74,26.62 30.18,24.18 32.92,24.18 MOTOR_POWER_1.7 | C11.2 77.57,76.15 81.08,76.15 83.52,73.71 86.26,73.71 MOTOR_POWER_11.7 | C14.2 24.23,76.15 27.74,76.15 30.18,73.71 32.92,73.71 MOTOR_POWER_14.7 | C13.2 41.91,76.15 45.57,76.15 48.01,73.71 50.75,73.71 MOTOR_POWER_13.7 | C12.2 62.18,73.71 68.58,73.71 MOTOR_POWER_12.7 | C6.2 77.57,49.48 81.08,49.48 83.52,47.04 86.26,47.04 MOTOR_POWER_6.7 | C7.2 59.74,49.48 63.25,49.48 65.68,47.04 68.58,47.04 MOTOR_POWER_7.7 | C1.2 2.44,30.58 1.98,30.58 1.37,31.19 1.37,34.85 2.13,35.61 3.05,35.61 6.25,38.81 6.25,47.04 | 6.25,47.04 6.25,49.48 C10.2 | 6.25,47.04 14.02,47.04 | 14.02,47.04 15.24,47.04 MOTOR_POWER_10.7 | v11.73,77.37 3.81,69.44 J1.1 | MOTOR_POWER_5.7 15.24,24.94 16.61,26.31 16.61,30.89 16.76,31.04 16.76,34.54 15.7,35.61 14.78,35.61 14.02,36.37 14.02,47.04
  Bottom 0.152: C4.2 59.74,26.62 63.25,26.62 65.68,24.18 68.58,24.18 MOTOR_POWER_3.7 | C2.2 22.86,25.4 17.37,25.4 16.15,24.18 15.24,24.18 MOTOR_POWER_5.7 | MOTOR_POWER_1.7 34.29,25.4 38.56,25.4 39.78,26.62 41.91,26.62 C3.2 | C12.2 59.59,76.15 57.61,76.15 56.39,74.93 52.12,74.93 50.9,73.71 MOTOR_POWER_13.7 | MOTOR_POWER_14.7 33.07,73.71 33.83,73.71 35.05,74.93 40.69,74.93 41.91,76.15 C13.2 | MOTOR_POWER_11.7 86.26,73.71 86.26,74.02 82.3,77.98 68.58,77.98 67.36,76.76 67.36,74.93 68.58,73.71 MOTOR_POWER_12.7 | 41.91,49.48 42.98,49.48 45.41,47.04 50.75,47.04 MOTOR_POWER_8.7 51.97,45.82 56.39,45.82 59.59,49.02 59.59,49.48 C7.2 | C10.2 3.81,52.07 J2.1 3.81,58.01 2.44,59.38 2.44,61.98 3.81,63.35 J1.1 | MOTOR_POWER_10.7 15.24,47.04 16.46,48.26 20.73,48.26 21.95,49.48 24.08,49.48 C9.2 24.23,49.48 27.74,49.48 30.18,47.04 32.92,47.04 MOTOR_POWER_9.7 33.07,46.89 34.14,45.82 38.71,45.82 41.91,49.02 41.91,49.48 | 41.91,49.48 C8.2 | C6.2 77.42,49.63 75.29,49.63 74.22,50.7 73.15,50.7 72.39,49.94 72.39,49.02 71.63,48.26 69.8,48.26 68.58,47.04 MOTOR_POWER_7.7 | v11.73,77.37 20.88,77.37 21.95,76.3 24.08,76.3 C14.2
N$84
  Top 0.152: MOTOR_POWER_4.8 86.26,26.77 82.6,26.77 C5.1 82.45,26.77 81.38,26.77 79.7,28.45 66.45,28.45 64.77,26.77 C4.1 64.77,26.62 61.11,26.62 60.05,25.55 58.67,25.55 56.39,27.84 51.97,27.84 MOTOR_POWER_2.8 50.75,26.77 47.09,26.77 C3.1 | C1.1 11.43,26.77 15.24,26.77 MOTOR_POWER_5.8 | 31.85,26.77 32.92,26.77 MOTOR_POWER_1.8 | 31.85,26.77 29.26,26.77 C2.1 | C11.1 82.6,76.3 86.26,76.3 MOTOR_POWER_11.8 | C12.1 64.77,76.3 68.58,76.3 MOTOR_POWER_12.8 | C14.1 29.26,76.3 32.92,76.3 MOTOR_POWER_14.8 | C13.1 47.09,76.3 50.75,76.3 MOTOR_POWER_13.8 | J1.2 3.81,72.8 2.44,71.43 2.44,68.68 3.81,67.31 J2.2 3.81,59.84 11.43,52.22 11.43,49.63 | C6.1 82.6,49.63 86.26,49.63 MOTOR_POWER_6.8 | 64.77,49.63 68.58,49.63 MOTOR_POWER_7.8 | 11.43,49.63 15.24,49.63 MOTOR_POWER_10.8 | 64.77,49.63 63.55,49.63 62.48,50.7 51.97,50.7 MOTOR_POWER_8.8 | 64.77,49.63 C7.1 | 11.43,49.63 C10.1 | 31.85,26.77 31.85,48.41 32.92,49.48 MOTOR_POWER_9.8
  Bottom 0.152: C5.1 81.08,28.14 70.87,28.14 69.49,26.77 68.58,26.77 MOTOR_POWER_3.8 | C2.1 28.04,27.84 17.22,27.84 16.15,26.77 15.24,26.77 MOTOR_POWER_5.8 | C3.1 46.94,26.77 43.28,26.77 42.22,27.84 34.14,27.84 33.07,26.77 MOTOR_POWER_1.8 | MOTOR_POWER_14.8 33.07,76.3 33.98,76.3 35.05,77.37 45.87,77.37 46.94,76.3 C13.1 | MOTOR_POWER_13.8 51.97,77.37 60.05,77.37 61.11,76.3 64.77,76.3 C12.1 | C11.1 82.45,76.3 78.94,76.3 77.57,77.67 69.95,77.67 68.58,76.3 MOTOR_POWER_12.8 | MOTOR_POWER_8.8 50.75,49.48 50.75,48.72 49.84,47.8 49.23,47.8 47.55,49.48 47.09,49.48 C8.1 46.94,49.63 43.28,49.63 42.22,50.7 34.14,50.7 33.07,49.63 MOTOR_POWER_9.8 32.92,49.63 29.26,49.63 C9.1 28.04,50.7 17.22,50.7 16.15,49.63 15.24,49.63 MOTOR_POWER_10.8 | C6.1 82.45,49.63 78.94,49.63 77.57,51 69.95,51 68.58,49.63 MOTOR_POWER_7.8 | C14.1 29.11,76.15 25.6,76.15 24.38,74.93 5.79,74.93 3.81,72.95 J1.2
N$85
  Top 0.152: B1.A14 88.85,5.13 88.09,5.13 84.89,8.33 76.81,8.33 73.76,11.38 Z_RIGHT.2
N$86
  Top 0.152: Z_RIGHT.1 74.52,8.03 82.6,8.03 85.5,5.13 86.26,5.13 B1.A13
N$87
  Top 0.152: B1.A12 83.82,5.13 82.91,5.13 80.31,7.72 57,7.72 55.93,8.79 Z_LEFT.1
N$88
  Bottom 0.152: Z_LEFT.2 57.15,10.16 75.44,10.16 80.47,5.13 81.23,5.13 B1.A11
N$89
  Bottom 0.152: Z_LEFT.8 67.21,15.34 74.07,15.34 82.45,6.96 82.45,4.52 81.84,3.91 80.77,3.91 79.7,4.98 78.79,4.98 B1.A10
N$90
  Top 0.152: B1.A9 76.2,4.98 75.29,4.98 73.91,3.61 49.23,3.61 44.04,8.79 38.1,8.79 RIGHT_STEP.1
N$91
  Bottom 0.152: B1.A8 73.61,5.13 70.26,5.13 67.67,7.72 52.73,7.72 51.97,8.48 51.97,9.4 51.21,10.16 39.32,10.16 38.1,11.38 RIGHT_STEP.2
N$92
  Top 0.152: B1.A7 68.58,4.98 67.67,4.98 66.6,3.91 52.73,3.91 51.97,4.67 51.97,5.59 39.32,18.24 39.32,25.4 38.1,26.62 RIGHT_STEP.8
N$93
  Bottom 0.152: LEFT_STEP.1 26.21,3 63.09,3 65.08,4.98 65.99,4.98 B1.A6
N$94
  Bottom 0.152: B1.A5 63.4,4.98 62.64,4.98 60.96,3.3 28.5,3.3 20.42,11.38 LEFT_STEP.2
N$95  (via drill 0.35)
  Top 0.152: v45.26,6.66 33.53,6.66 21.49,18.69 21.49,25.55 20.42,26.62 LEFT_STEP.8
  Bottom 0.152: v45.26,6.66 58.52,6.66 60.05,5.13 60.96,5.13 B1.A4
N$96
  Top 0.152: J6.1 89,8.94 89,9.86 93.88,14.73 93.88,15.19 B1.50
N$97
  Top 0.152: J5.1 71.17,8.94 71.17,9.7 72.39,10.92 72.39,11.84 73.3,12.75 89.76,12.75 93.57,16.56 95.25,16.56 96.47,17.78 B1.49
N$98  (via drill 0.35)
  Top 0.152: v49.84,22.81 46.79,22.81 44.5,20.52 44.5,13.51 50.29,7.72 51.36,7.72 52.43,8.79 53.34,8.79 J4.1
  Bottom 0.152: v49.84,22.81 51.21,22.81 52.12,23.72 52.12,27.23 53.34,28.45 82.91,28.45 85.95,25.4 86.87,25.4 87.63,24.64 87.63,23.72 88.54,22.81 89.46,22.81 93.88,18.39 93.88,17.78 B1.48
N$99  (via drill 0.35)
  Top 0.152: v48.62,28.75 61.27,28.75 61.57,29.06 88.54,29.06 93.57,24.03 94.49,24.03 95.25,23.27 95.25,21.59 B1.47
  Bottom 0.152: v48.62,28.75 48.62,22.81 38.56,12.75 37.64,12.75 36.88,11.99 36.88,11.07 35.66,9.86 35.66,8.94 J3.1
N$100
  Bottom 0.152: PUMP1.8 2.59,8.79 13.56,8.79 19.66,2.69 91.29,2.69 97.69,9.09 97.69,15.8 96.93,16.56 96.01,16.56 95.25,17.32 95.25,19 94.03,20.22 B1.46
N$101
  Top 0.152: PUMP1.7 2.59,11.38 10.52,11.38 18.9,3 91.59,3 98.6,10.01 98.6,20.83 96.62,22.81 B1.45
N$102  (via drill 0.35)
  Top 0.152: v97.99,20.52 97.99,9.86 91.44,3.3 19.05,3.3 3.81,18.54 3.81,25.4 PUMP1.1
  Bottom 0.152: v97.99,20.52 96.93,21.59 96.01,21.59 94.79,22.81 94.03,22.81 B1.44
N$103
  Top 0.152: B1.43 95.71,25.4 94.34,26.77 91.29,26.77 88.09,29.97 75.44,29.97 PUMP2.8
N$104
  Bottom 0.152: B1.42 92.66,25.4 88.24,29.82 78.18,29.82 73.76,34.24 PUMP2.7
N$105
  Bottom 0.152: B1.41 96.47,27.99 95.71,27.99 94.49,29.21 93.57,29.21 90.37,32.41 90.37,38.35 88.09,40.64 83.82,40.64 74.98,49.48 73.76,49.48 PUMP2.1
N$106  (via drill 0.35)
  Top 0.152: v75.74,30.58 87.94,30.58 90.53,27.99 93.88,27.99 B1.40
  Bottom 0.152: v75.74,30.58 57,30.58 55.93,31.65 PUMP3.8
N$107
  Top 0.152: B1.39 96.47,30.58 95.56,30.58 94.34,31.8 88.09,31.8 86.87,33.02 76.66,33.02 74.22,35.46 65.99,35.46 64.92,34.39 55.93,34.39 PUMP3.7
N$108
  Bottom 0.152: B1.38 93.88,30.58 93.88,31.34 90.68,34.54 90.68,41.86 90.07,42.47 90.07,51 89.31,51.77 89.31,52.38 89,52.68 87.48,52.68 86.56,51.77 58.06,51.77 55.93,49.63 PUMP3.1
N$109  (via drill 0.35)
  Top 0.152: v69.49,38.2 68.28,38.2 65.68,35.61 50.44,35.61 46.63,31.8 38.1,31.8 PUMP4.8 | v89.76,38.05 93.57,34.24 94.79,34.24 96.01,33.02 B1.37
  Bottom 0.152: v69.49,38.2 70.71,38.2 73.15,40.64 83.36,40.64 85.95,38.05 v89.76,38.05
N$110
  Top 0.152: B1.36 89.31,33.02 86.72,35.61 85.8,35.61 74.83,46.58 74.83,50.09 73.76,51.16 50.75,51.16 42.52,42.93 42.52,38.81 38.1,34.39 PUMP4.7
N$111
  Top 0.152: B1.35 96.47,35.61 96.47,36.37 95.25,37.59 95.25,41.1 94.34,42.01 93.42,42.01 90.07,45.36 90.07,50.09 88.7,51.46 39.93,51.46 38.1,49.63 PUMP4.1
N$112
  Top 0.152: PUMP5.8 20.27,31.8 20.27,32.56 19.05,33.78 19.05,57.56 18.75,57.86 18.75,76.3 20.12,77.67 89.15,77.67 97.99,68.83 97.99,35.31 97.08,34.39 95.1,34.39 94.03,35.46 B1.34
N$113  (via drill 0.35)
  Top 0.152: v49.23,36.68 v47.24,38.66
  Bottom 0.152: v47.24,38.66 42.98,38.66 41,40.64 32.61,40.64 26.36,34.39 20.42,34.39 PUMP5.7 | v49.23,36.68 50.44,35.46 51.36,35.46 54.71,32.11 54.71,31.19 57.15,28.75 88.85,28.75 93.42,24.18 97.08,24.18 97.99,25.09 97.99,36.68 96.62,38.05 B1.33
N$114  (via drill 0.35)
  Top 0.152: v25.6,56.79 20.42,51.61 20.42,49.63 PUMP5.1
  Bottom 0.152: v25.6,56.79 27.13,56.79 32.61,62.28 42.37,62.28 44.81,64.72 52.88,64.72 55.47,62.13 56.39,62.13 57.15,61.37 57.15,60.45 56.39,59.69 55.47,59.69 54.71,58.93 54.71,57.86 58.06,54.51 87.63,54.51 89.61,52.53 89.61,51.92 90.53,51 90.53,42.47 92.51,40.49 92.51,39.57 B1.32
N$115
  Bottom 0.152: PUMP6.8 2.44,31.65 2.44,30.89 1.37,29.82 1.37,23.57 1.98,22.96 4.12,22.96 14.02,32.87 14.02,34.85 14.63,35.46 17.37,35.46 19.81,33.02 27.43,33.02 32.46,38.05 63.09,38.05 68.12,33.02 70.71,33.02 73.15,35.46 80.92,35.46 86.26,30.12 90.07,30.12 93.42,26.77 97.08,26.77 97.69,27.38 97.69,36.07 96.93,36.83 96.01,36.83 95.25,37.59 95.25,38.51 94.34,39.42 93.42,39.42 92.81,40.03 92.81,41.25 93.42,41.86 95.25,41.86 96.47,40.64 B1.31
N$116  (via drill 0.35)
  Top 0.152: v7.47,15.8 7.47,28.6 2.59,33.48 2.59,34.24 PUMP6.7
  Bottom 0.152: v7.47,15.8 7.47,14.58 3.05,10.16 2.13,10.16 1.37,9.4 1.37,8.33 7.92,1.78 90.83,1.78 98.6,9.55 98.6,37.74 96.93,39.42 95.25,39.42 94.03,40.64 B1.30
N$117
  Bottom 0.152: PUMP6.1 2.44,49.63 2.44,58.93 2.13,59.23 2.13,69.6 3.66,71.12 18.59,71.12 19.96,72.49 27.58,72.49 33.38,78.28 82.6,78.28 85.95,74.93 86.87,74.93 87.63,74.17 87.63,64.41 97.69,54.36 97.69,44.3 96.62,43.23 B1.29
N$118
  Top 0.152: PUMP7.8 75.44,56.64 85.8,56.64 92.81,49.63 94.34,49.63 95.25,48.72 95.25,45.21 94.03,43.99 94.03,43.23 B1.28
N$119
  Top 0.152: B1.27 96.62,45.82 96.62,46.58 97.69,47.65 97.69,53.9 89.31,62.28 84.28,62.28 74.22,72.34 73.15,72.34 72.39,71.58 72.39,62.28 73.61,61.06 PUMP7.7
N$120
  Bottom 0.152: B1.26 92.81,46.89 92.81,49.63 90.53,51.92 90.53,56.03 86.87,59.69 85.95,59.69 85.19,60.45 85.19,63.8 73.76,75.23 73.76,76.15 PUMP7.1
N$121
  Bottom 0.152: B1.25 96.47,48.26 96.47,47.35 95.25,46.13 95.25,45.21 94.49,44.45 93.57,44.45 90.83,47.19 90.83,51.16 89.92,52.07 89.92,52.68 85.65,56.95 57.3,56.95 55.93,58.32 PUMP8.8
N$122
  Bottom 0.152: PUMP8.7 54.71,62.13 42.67,62.13 40.23,59.69 37.64,59.69 36.88,58.93 36.88,58.78 31.55,53.44 B1.12
N$123  (via drill 0.35)
  Top 0.152: v42.98,61.52 49.68,61.52 50.44,62.28 51.36,62.28 54.71,65.63 54.71,75.08 55.78,76.15 PUMP8.1
  Bottom 0.152: v42.98,61.52 34.9,53.44 34.14,53.44 B1.11
N$124
  Top 0.152: B1.10 36.58,56.79 38.1,58.32 PUMP9.8
N$125
  Top 0.152: PUMP9.7 38.1,60.15 39.32,58.93 39.32,53.59 39.17,53.44 B1.9
N$126
  Top 0.152: PUMP9.1 38.1,75.39 39.62,73.86 39.62,55.42 41.6,53.44 B1.8
N$127
  Top 0.152: B1.7 45.72,53.29 43.89,53.29 42.37,51.77 31.39,51.77 30.18,52.98 30.18,53.9 25.76,58.32 20.42,58.32 PUMP10.8
N$128
  Bottom 0.152: B1.6 48.16,53.29 47.4,53.29 45.87,51.77 28.8,51.77 27.58,52.98 27.58,53.9 20.42,61.06 PUMP10.7
N$129
  Top 0.152: PUMP10.1 21.49,77.37 38.71,77.37 39.93,76.15 39.93,63.65 50.14,53.44 50.75,53.44 B1.5

### Text on the board
tNames: Arduino Mega 2560 Shield / 10 Stepper Drivers | Designed by Philip Dettinger / Cell Systems Dynamics Group - ETHZurich | + | - | + | - | + | - | + | - | + | FAN | - | + | P10 | P9 | P8 | P7 | POWER | - | - | + | - | + | - | + | - | + | - | + | P6 | P5 | P4 | P3 | P2 | - | + | - | + | - | + | - | + | - | + | P1 | L | R | Z1 | Z2
bNames: ENA | MV+ | M1 | MGND | M2 | M3 | RST | SLP | STP | LV+ | DIR | LGND